# EAGLE design HVDCS_S3A6_48_TQFP_v1p00 (EAGLE 9.6.2)
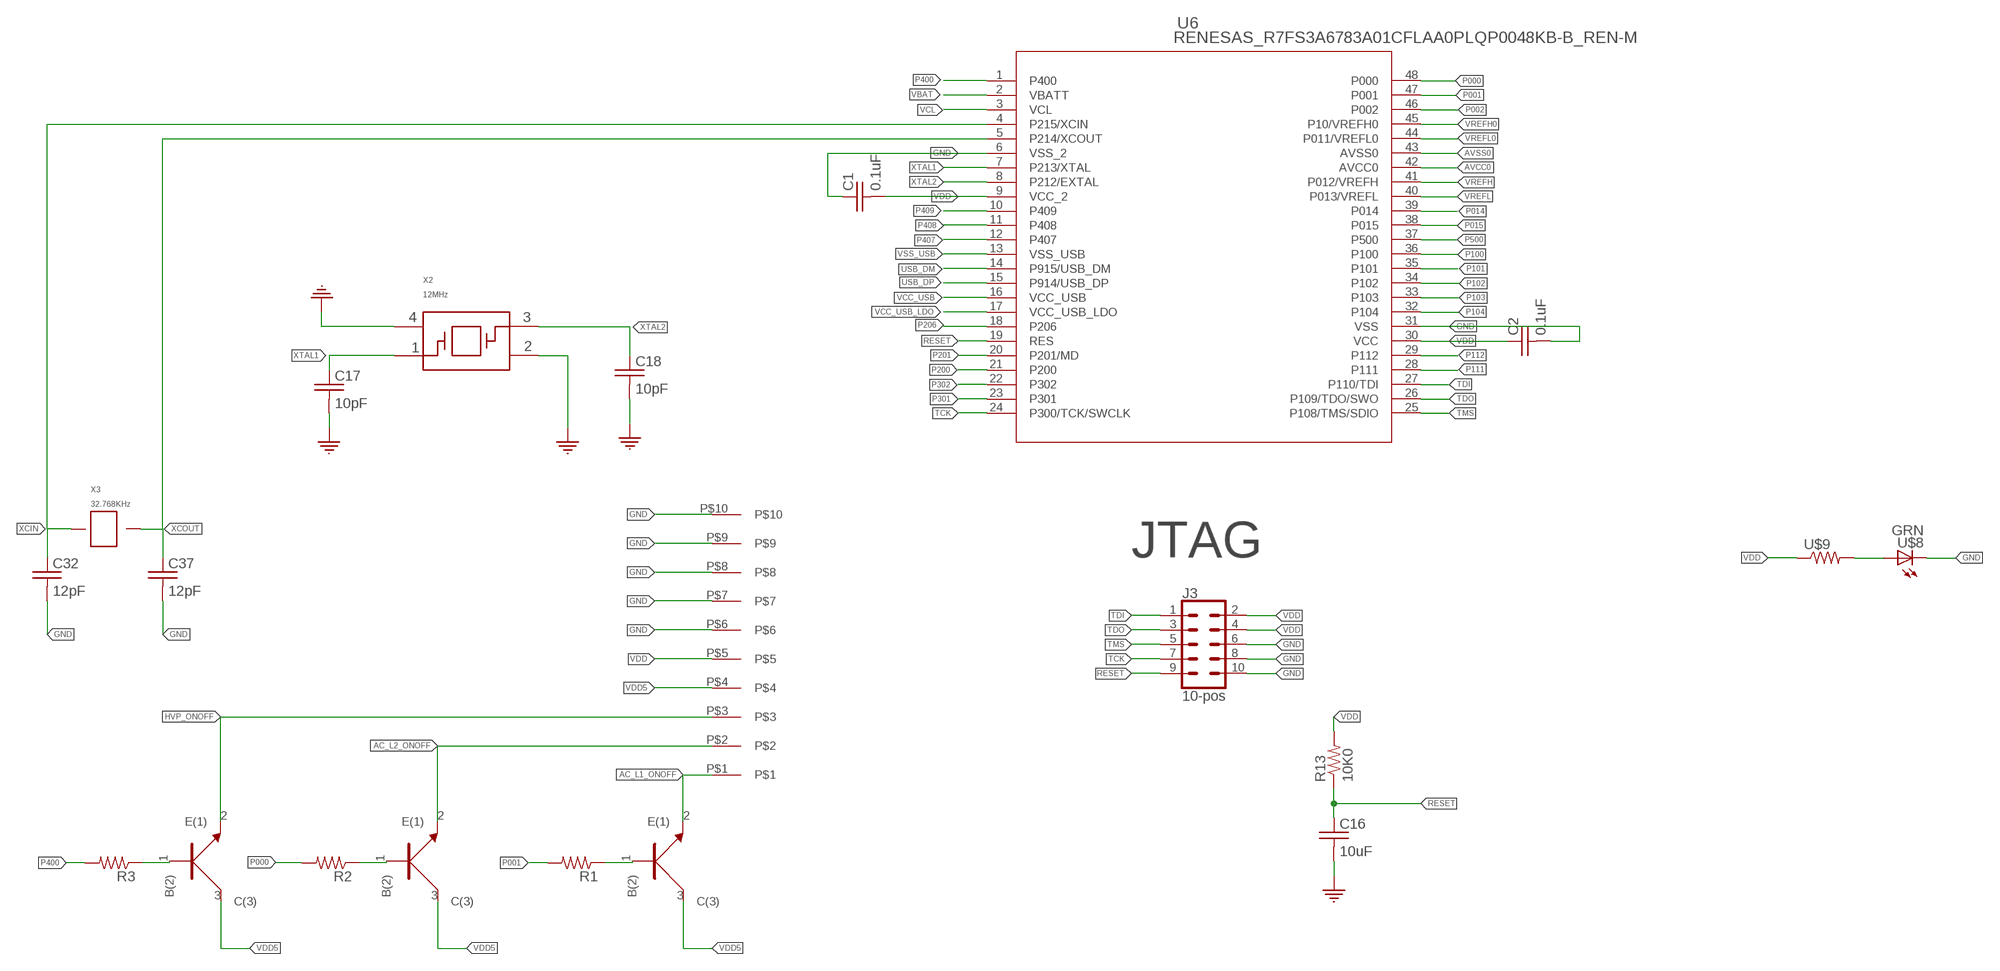
[diagram p0: schematic, sheet 1]

## Parts
C1  0.1uF  C_0402_0.1UF  [0402]
C2  0.1uF  C_0402_0.1UF  [0402]
C16  10uF  C_0402_10UF  [0402]
C17  10pF  C_0402_18PF  [0402]
C18  10pF  C_0402_18PF  [0402]
C32  12pF  C_0402_12PF  [0402]
C37  12pF  C_0402_12PF  [0402]
J3  10-pos  CONN_05X2_RAPTH  [2X5]
R1  R_0402  [0402]
R2  R_0402  [0402]
R3  R_0402  [0402]
R13  10K0  R_0402_10K0  [0402]
U1  NPN  BC846BW  [SOT323]
U2  NPN  BC846BW  [SOT323]
U3  NPN  BC846BW  [SOT323]
U6  RENESAS_R7FS3A6783A01CFLAA0PLQP0048KB-B_REN-M  [PLQP0048KB-B_REN-M]
U$5  1_X_10_HEADER_GENERIC_.1INCH  [HEADER_1_X_10_.1_INCH]
U$8  LED_0805_GREEN  [LED_0805_GREEN]
U$9  470R0  R_0402_470R0  [0402]
X2  12MHz  XTAL_24_MHZ  [SMD_3225]
X3  32.768KHz  XTAL_32.768KHZ  [SMD_X_2_PADS]

## Nets
AC_L1_ONOFF: U1.2(E(1)) U$5.P$1
AC_L2_ONOFF: U2.2(E(1)) U$5.P$2
AVCC0: U6.42(AVCC0)
AVSS0: U6.43(AVSS0)
GND: C1.P$1 C2.P$2 C16.P$2 C17.P$2 C18.P$2 C32.P$2 C37.P$2 J3.6 J3.8 J3.10 U6.6(VSS_2) U6.31(VSS) U$5.P$6 U$5.P$7 U$5.P$8 U$5.P$9 U$5.P$10 U$8.C X2.2 X2.4
HVP_ONOFF: U3.2(E(1)) U$5.P$3
N$1: U$8.A U$9.P$2
N$2: R1.P$1 U1.1(B(2))
N$3: R2.P$1 U2.1(B(2))
N$4: R3.P$1 U3.1(B(2))
P000: R2.P$2 U6.48(P000)
P001: R1.P$2 U6.47(P001)
P002: U6.46(P002)
P014: U6.39(P014)
P015: U6.38(P015)
P100: U6.36(P100)
P101: U6.35(P101)
P102: U6.34(P102)
P103: U6.33(P103)
P104: U6.32(P104)
P111: U6.28(P111)
P112: U6.29(P112)
P200: U6.21(P200)
P201: U6.20(P201/MD)
P206: U6.18(P206)
P301: U6.23(P301)
P302: U6.22(P302)
P400: R3.P$2 U6.1(P400)
P407: U6.12(P407)
P408: U6.11(P408)
P409: U6.10(P409)
P500: U6.37(P500)
RESET: C16.P$1 J3.9 R13.P$1 U6.19(RES)
TCK: J3.7 U6.24(P300/TCK/SWCLK)
TDI: J3.1 U6.27(P110/TDI)
TDO: J3.3 U6.26(P109/TDO/SWO)
TMS: J3.5 U6.25(P108/TMS/SDIO)
USB_DM: U6.14(P915/USB_DM)
USB_DP: U6.15(P914/USB_DP)
VBAT: U6.2(VBATT)
VCC_USB: U6.16(VCC_USB)
VCC_USB_LDO: U6.17(VCC_USB_LDO)
VCL: U6.3(VCL)
VDD: C1.P$2 C2.P$1 J3.2 J3.4 R13.P$2 U6.9(VCC_2) U6.30(VCC) U$5.P$5 U$9.P$1
VDD5: U1.3(C(3)) U2.3(C(3)) U3.3(C(3)) U$5.P$4
VREFH: U6.41(P012/VREFH)
VREFH0: U6.45(P10/VREFH0)
VREFL: U6.40(P013/VREFL)
VREFL0: U6.44(P011/VREFL0)
VSS_USB: U6.13(VSS_USB)
XCIN: C32.P$1 U6.4(P215/XCIN) X3.P$1
XCOUT: C37.P$1 U6.5(P214/XCOUT) X3.P$2
XTAL1: C17.P$1 U6.7(P213/XTAL) X2.1
XTAL2: C18.P$1 U6.8(P212/EXTAL) X2.3

## Notes on the sheet
- JTAG

## Library data of the parts
C1 C2 = 3D_MIG_Controller:C_0402_0.1UF; PARTNO: CL05F104ZO5NNNC
C16 = 3D_MIG_Controller:C_0402_10UF; PARTNO: CL05A106MP8NUB8
C17 C18 = 3D_MIG_Controller:C_0402_18PF; PARTNO: UMK105CG180JV-F; VALUE: 18pF
C32 C37 = 3D_MIG_Controller:C_0402_12PF; PARTNO: CL05C120JB5NNNC
J3 = 3D_MIG_Controller:CONN_05X2_RA: Connector Header Through Hole, Right Angle 10 position 0.100" (2.54mm); PARTNO: PH2RA-10-UA
R1-R3 = 3D_MIG_Controller:R_0402
R13 = 3D_MIG_Controller:R_0402_10K0; PARTNO: RMCF0402JT10K0
U1-U3 = 3D_MIG_Controller:BC846BW: Bipolar (BJT) Transistor NPN 100MHz Surface Mount SOT-323; PARTNO: BC846BW_NPN
U6 = 3D_MIG_Controller:RENESAS_R7FS3A6783A01CFLAA0; BUILT_BY: EMA_Cory; COPYRIGHT: Copyright (C) 2021 Accelerated Designs. All rights reserved; DATASHEET: https://www.renesas.com/us/en/document/dst/s3a6-microcontroller-group-datasheet-r01ds0308eu0120?language=en; MANUFACTURER_PART_NUMBER: R7FS3A6783A01CFL#AA0; SOURCELIBRARY: Add_to_database_2021-06-10; VENDOR: Renesas Electronics
U$5 = 3D_MIG_Controller:1_X_10_HEADER_GENERIC_.1INCH
U$8 = 3D_MIG_Controller:LED_0805_GREEN
U$9 = 3D_MIG_Controller:R_0402_470R0; PARTNO: RMCF0402JT470R
X2 = 3D_MIG_Controller:XTAL_24_MHZ; PARTNO: FA-238 24.0000MB-C3; VALUE: 24MHz
X3 = 3D_MIG_Controller:XTAL_32.768KHZ; PARTNO: ABS07-32.768KHZ-T

## Board
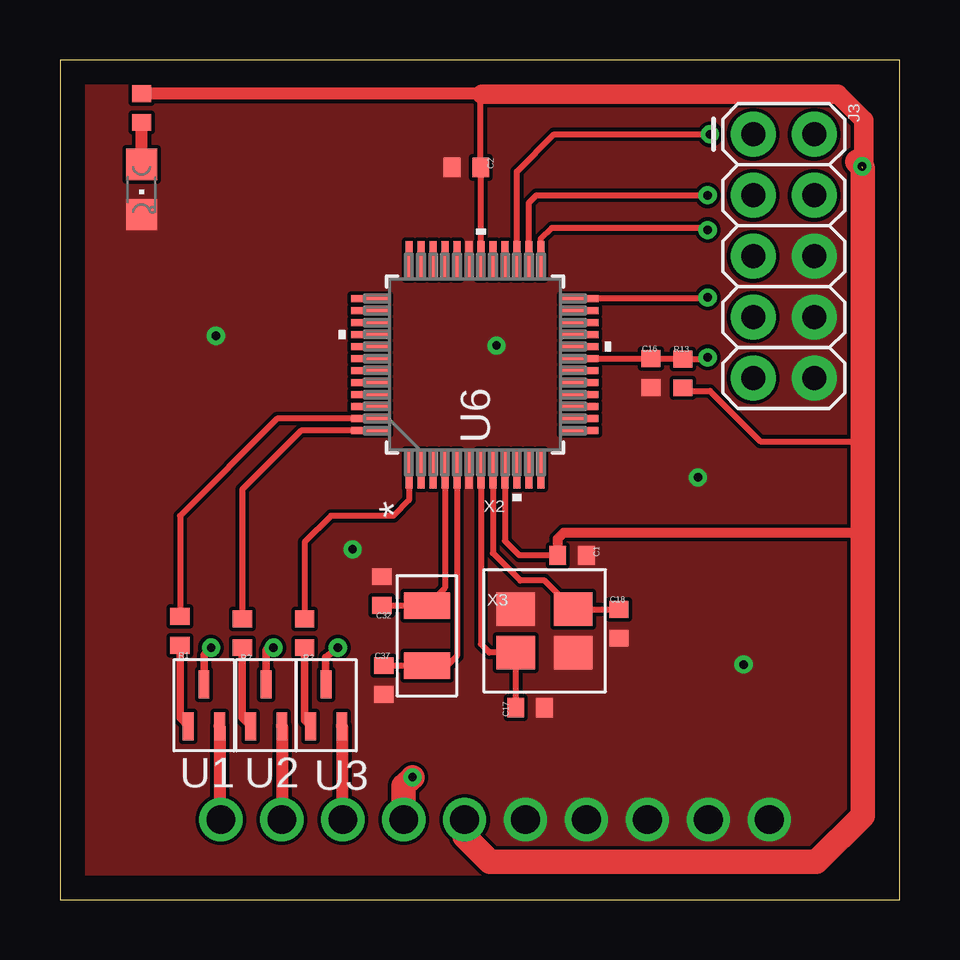
[diagram p1: board, top side]
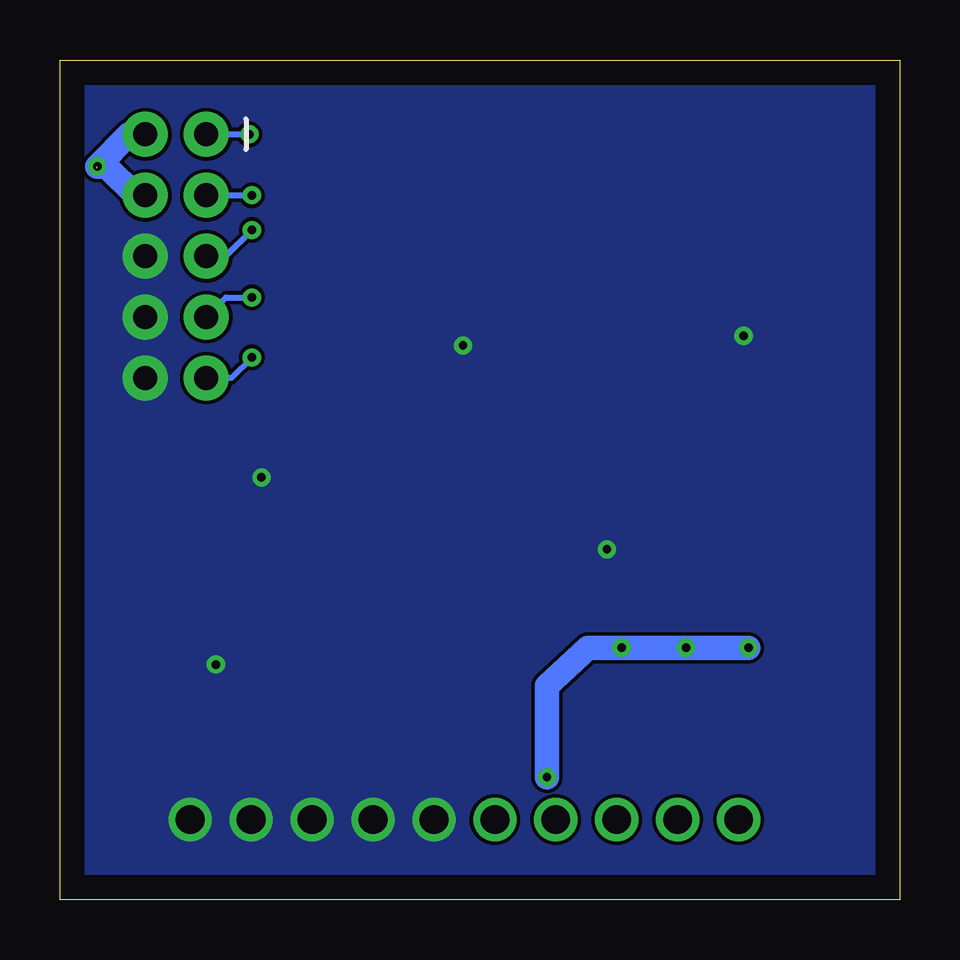
[diagram p2: board, bottom side, seen from below]

Size 35 x 35 mm. Coordinates in mm from the lower left corner, seen from the top.
Outline: 0,0 35,0 35,35 0,35 0,0
Copper layers (1*16): Top 0.035mm / dielectric 1.5mm / Bottom 0.035mm
Design rules "default *": minimum track width 6mil, minimum drill 0.35mm, track to track 6mil, track to pad 6mil, pad to pad 6mil, via to via 6mil, smd to smd 6mil, copper to edge 40mil, drill to drill 6mil, minimum pad ring 10mil, minimum via ring 8mil, stop-mask expansion 4mil, vias tented up to drill 0mil, thermal gap 10mil

### Footprints (pad centres in the part's own frame; a part is rotated, then mirrored left to right if it is on the bottom)
0402 = smd 0.8 x 0.7: P$1 0,0.6; P$2 0,-0.6
2X5 = drill 1 pad 1.88: 1 0,0; 2 0,2.54; 3 2.54,0; 4 2.54,2.54; 5 5.08,0; 6 5.08,2.54; 7 7.62,0; 8 7.62,2.54; 9 10.16,0; 10 10.16,2.54
SOT323 = smd 0.457 x 1.168: 1 -0.65,-0.876; 2 0.65,-0.876; 3 0,0.876
PLQP0048KB-B_REN-M = smd 1.6 x 0.279: 1 -4.356,2.75; 2 -4.356,2.25; 3 -4.356,1.75; 4 -4.356,1.25; 5 -4.356,0.75; 6 -4.356,0.25; 7 -4.356,-0.25; 8 -4.356,-0.75; 9 -4.356,-1.25; 10 -4.356,-1.75; 11 -4.356,-2.25; 12 -4.356,-2.75; 25 4.356,-2.75; 26 4.356,-2.25; 27 4.356,-1.75; 28 4.356,-1.25; 29 4.356,-0.75; 30 4.356,-0.25; 31 4.356,0.25; 32 4.356,0.75; 33 4.356,1.25; 34 4.356,1.75; 35 4.356,2.25; 36 4.356,2.75 | smd 0.279 x 1.6: 13 -2.75,-4.356; 14 -2.25,-4.356; 15 -1.75,-4.356; 16 -1.25,-4.356; 17 -0.75,-4.356; 18 -0.25,-4.356; 19 0.25,-4.356; 20 0.75,-4.356; 21 1.25,-4.356; 22 1.75,-4.356; 23 2.25,-4.356; 24 2.75,-4.356; 37 2.75,4.356; 38 2.25,4.356; 39 1.75,4.356; 40 1.25,4.356; 41 0.75,4.356; 42 0.25,4.356; 43 -0.25,4.356; 44 -0.75,4.356; 45 -1.25,4.356; 46 -1.75,4.356; 47 -2.25,4.356; 48 -2.75,4.356
HEADER_1_X_10_.1_INCH = drill 1.2 pad 1.6: P$1 -24.13,-1.27; P$2 -21.59,-1.27; P$3 -19.05,-1.27; P$4 -16.51,-1.27; P$5 -13.97,-1.27; P$6 -11.43,-1.27; P$7 -8.89,-1.27; P$8 -6.35,-1.27; P$9 -3.81,-1.27; P$10 -1.27,-1.27
LED_0805_GREEN = smd 1.3 x 1.3: A 0,-1.05; C 0,1.05
SMD_3225 = smd 1.6 x 1.4: 1 -1.2,-0.9; 2 1.2,-0.9; 3 1.2,0.9; 4 -1.2,0.9
SMD_X_2_PADS = smd 1.9 x 1.1: P$1 0,1.25; P$2 0,-1.25

### Placement (x,y rotation side)
C1  21.35,14.35 270 top
C2  16.94,30.52 270 top
C16  24.64,21.95 0 top
C17  19.6,8 90 top
C18  23.3,11.5 0 top
C32  13.42,12.86 180 top
C37  13.5,9.15 0 top
J3  28.9,31.9 270 top
R1  5,11.2 180 top
R2  7.6,11.1 180 top
R3  10.2,11.1 180 top
R13  25.97,21.93 0 top
U1  6,8.1 0 top
U2  8.6,8.1 0 top
U3  11.1,8.1 0 top
U6  17.3,22.3 90 top
U$5  30.84,4.6 0 top
U$8  3.4,29.6 180 top
U$9  3.4,33 0 top
X2  20.2,11.2 0 top
X3  15.3,11 0 top

### Tracks (layer width: path | path; a pad name or v marks a point on that pad's centre or on a via)
AC_L1_ONOFF
  Top 0.508: U1.2 6.65,3.39 U$5.P$1
AC_L2_ONOFF
  Top 0.508: U2.2 U$5.P$2
GND  (via drill 0.35)
  other vias: 6.5,23.5 26.6,17.6 18.2,23.1 28.5,9.8 12.2,14.6
  pour Top (no thermals): 0,35 35,35 35,0 0,0
  pour Bottom (no thermals): 0,35 35,35 35,0 0,0
HVP_ONOFF
  Top 0.508: U3.2 11.75,3.37 U$5.P$3
N$1
  Top 0.508: U$8.A 3.52,30.8 3.4,31.05 U$9.P$2
N$2
  Top 0.305: U1.1 5,7.57 R1.P$1
N$3
  Top 0.305: R2.P$1 7.6,7.57 U2.1
N$4
  Top 0.305: R3.P$1 10.2,7.47 U3.1
P000
  Top 0.254: U6.48 10.05,19.55 7.6,17.1 R2.P$2
P001
  Top 0.254: U6.47 9.05,20.05 5,16 R1.P$2
P400
  Top 0.254: U6.1 14.55,16.65 13.9,16 11.3,16 10.2,14.9 R3.P$2
RESET  (via drill 0.35)
  Top 0.254: U6.19 C16.P$1 25.95,22.55 R13.P$1 26.93,22.53 v27,22.6
  Bottom 0.254: v27,22.6 27.86,21.74 J3.9
TCK  (via drill 0.35)
  Top 0.254: v27,25.1 27.15,25.05 U6.24
  Bottom 0.254: J3.7 28.08,25.1 v27,25.1
TDI  (via drill 0.35)
  Top 0.254: U6.27 19.05,30.35 20.6,31.9 v27.1,31.9
  Bottom 0.254: J3.1 v27.1,31.9
TDO  (via drill 0.35)
  Top 0.254: U6.26 19.55,29.05 19.86,29.36 v27,29.36
  Bottom 0.254: J3.3 v27,29.36
TMS  (via drill 0.35)
  Top 0.254: U6.25 20.05,27.55 20.5,28 26.91,28 v27,27.91
  Bottom 0.254: J3.5 28.09,26.82 v27,27.91
VDD  (via drill 0.35)  (1 unrouted)
  Top 0.254: R13.P$2 26.1,21.2 27.1,21.2 29.2,19.1 33.48,19.1 | U6.30 C2.P$1 17.54,33.52 17.6,33.58 | U6.9 18.55,14.95 19.15,14.35 C1.P$2
  Top 0.406: C1.P$2 20.75,15.05 21,15.3 33.48,15.3
  Top 0.508: 17.6,33.58 17.58,33.6 U$9.P$1
  Top 0.813: v33.45,30.56 33.51,30.62 33.51,32.5 32.43,33.58 17.6,33.58
  Top 1.016: U$5.P$5 16.87,2.63 17.94,1.56 31.54,1.56 33.48,3.5 33.48,15.3 33.48,19.1 33.48,30.5 | v33.45,30.56 33.24,30.77
  Bottom 0.508: J3.2 31.44,32.06
  Bottom 1.016: J3.4 31.85,29.36 33.05,30.56 v33.45,30.56 32.11,31.9 J3.2
VDD5  (via drill 0.35)
  Top 0.305: v11.58,10.5 11.08,10.1 11.08,9 U3.3 | v8.9,10.5 8.6,10.4 U2.3 | v6.3,10.5 6,10.2 U1.3
  Top 1.016: U$5.P$4 14.33,4.73 v14.7,5.1
  Bottom 1.016: v14.7,5.1 14.7,8.9 13,10.5 v11.58,10.5 v8.9,10.5 v6.3,10.5
XCIN
  Top 0.254: U6.4 16.05,13 X3.P$1 C32.P$1
XCOUT
  Top 0.254: U6.5 16.55,10.15 16.15,9.75 X3.P$2 C37.P$1
XTAL1
  Top 0.254: U6.7 17.55,10.65 17.9,10.3 X2.1 C17.P$1
XTAL2
  Top 0.254: U6.8 18.05,14.44 19.19,13.3 20.2,13.3 X2.3 C18.P$1